# EAGLE design IRIS v1.1 (EAGLE 6.5.0)
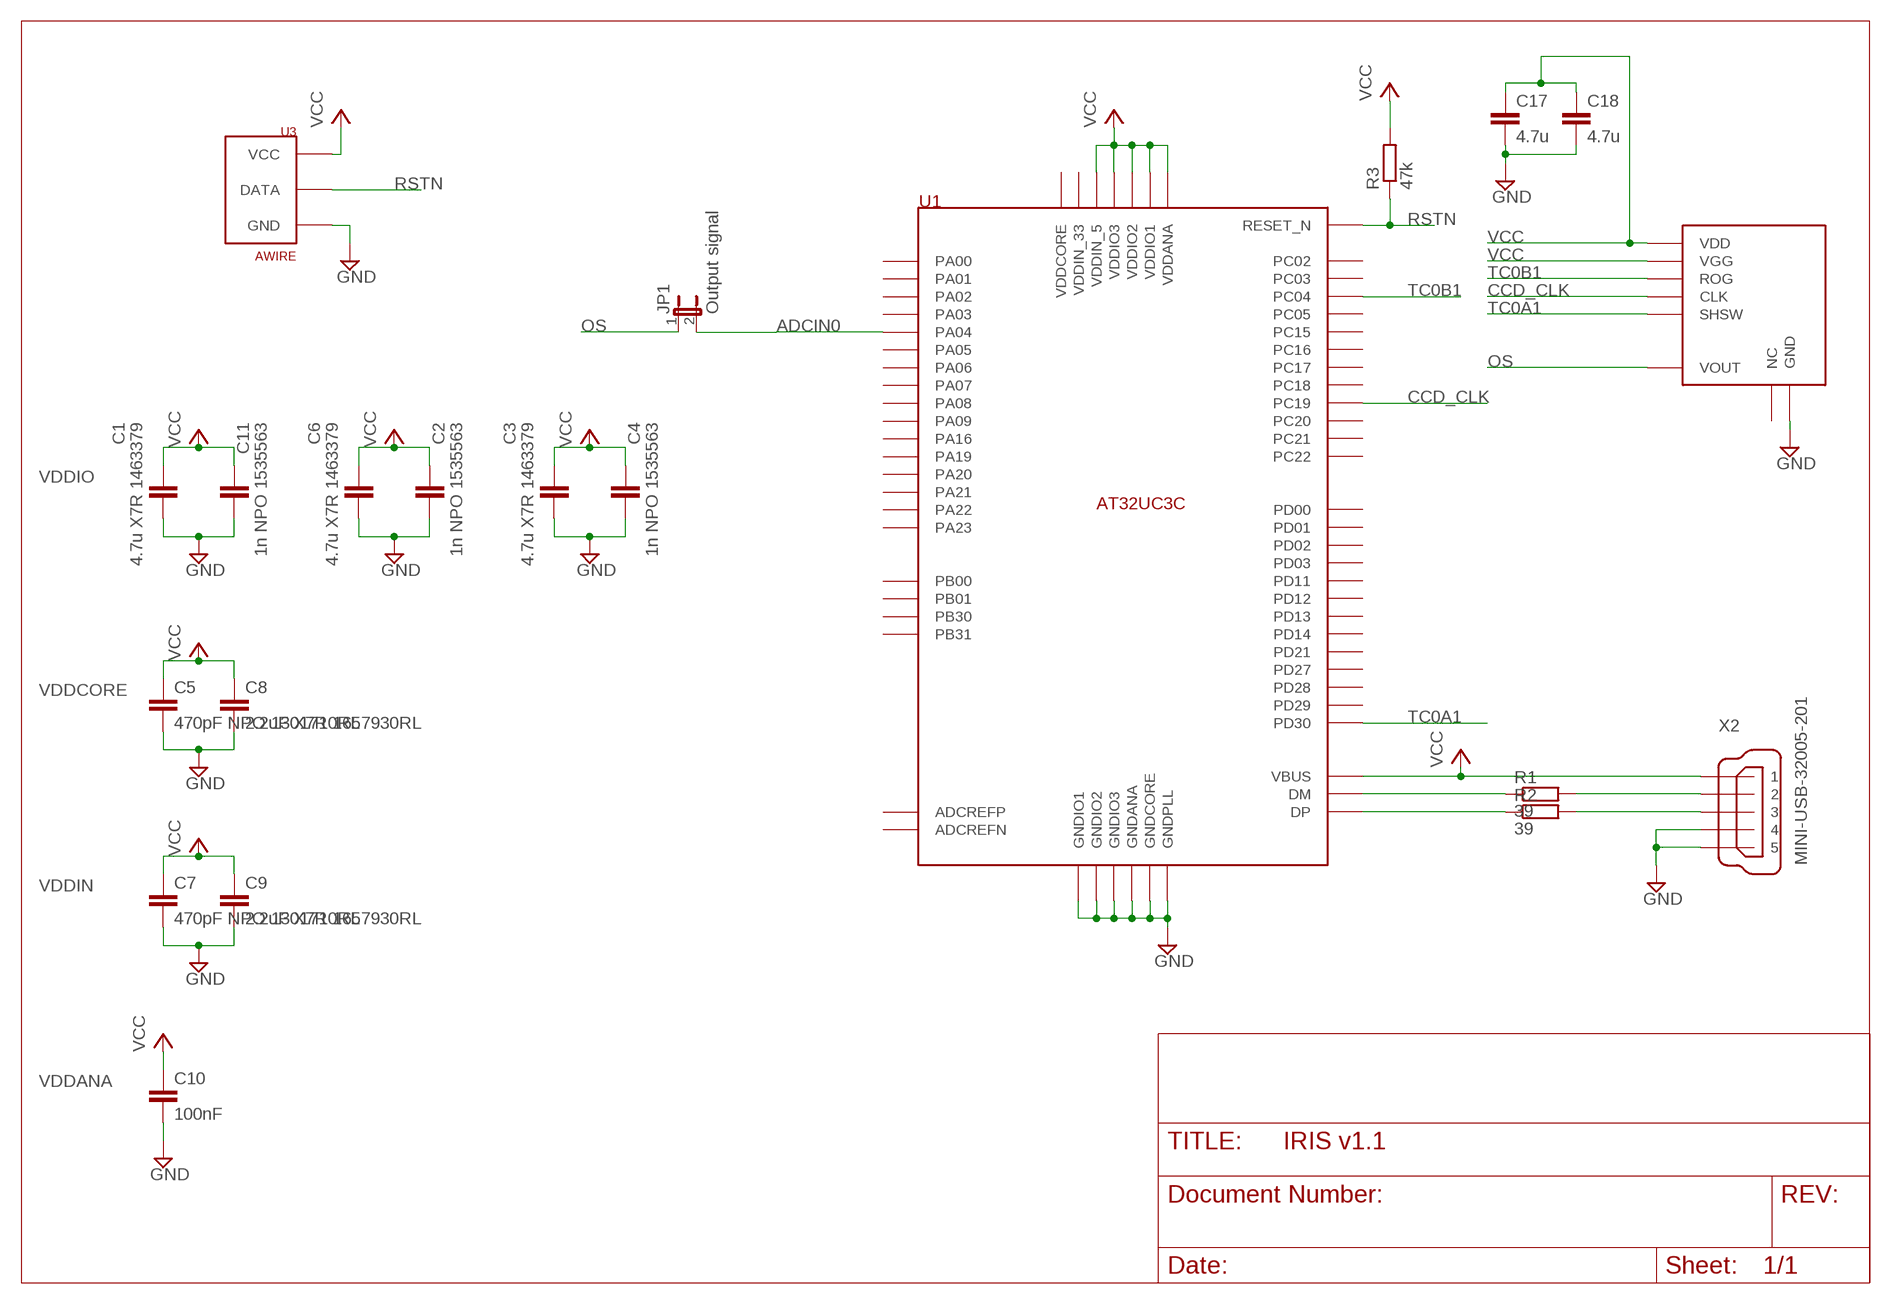
[diagram p0: schematic, sheet 1]

## Parts
C1  4.7u X7R 1463379  C-EUC0603  [C0603]
C2  1n NPO 1535563  C-EUC0402  [C0402]
C3  4.7u X7R 1463379  C-EUC0603  [C0603]
C4  1n NPO 1535563  C-EUC0402  [C0402]
C5  470pF NPO 1301710RL  C-EUC0603  [C0603]
C6  4.7u X7R 1463379  C-EUC0603  [C0603]
C7  470pF NPO 1301710RL  C-EUC0603  [C0603]
C8  2.2uF X7R 1657930RL  C-EUC0603  [C0603]
C9  2.2uF X7R 1657930RL  C-EUC0603  [C0603]
C10  100nF  C-EUC0603  [C0603]
C11  1n NPO 1535563  C-EUC0402  [C0402]
C17  4.7u  C-EUC0805  [C0805]
C18  4.7u  C-EUC0805  [C0805]
JP1  Output signal  JP1E  [JP1]
R1  39  R-EU_R0603  [R0603]
R2  39  R-EU_R0603  [R0603]
R3  47k  R-EU_R0603  [R0603]
U1  AT32UC3C  [TQFP64]
U3  AWIRE  [AWIRE]
U$1  ILX511  [ILX511]
X2  MINI-USB-32005-201  [32005-201]

## Nets
ADCIN0: JP1.2 U1.P$7(PA04)
CCD_CLK: U1.P$43(PC19) U$1.P$5(CLK)
GND: C1.2 C2.2 C3.2 C4.2 C5.2 C6.2 C7.2 C8.2 C9.2 C10.2 C11.2 C17.2 C18.2 U1.P$6(GNDIO1) U1.P$17(GNDANA) U1.P$26(GNDPLL) U1.P$30(GNDCORE) U1.P$36(GNDIO2) U1.P$52(GNDIO3) U3.P$3(GND) U$1.P$2(GND) U$1.P$3(GND) U$1.P$12(GND) U$1.P$16(GND) U$1.P$17(GND) U$1.P$19(GND) X2.4 X2.5
N$1: R1.1 U1.P$24(DM)
N$2: R2.1 U1.P$25(DP)
N$3: R1.2 X2.2
N$4: R2.2 X2.3
OS: JP1.1 U$1.P$1(VOUT)
RSTN: R3.1 U1.P$64(RESET_N) U3.P$2(DATA)
TC0A1: U1.P$61(PD30) U$1.P$4(SHSW)
TC0B1: U1.P$37(PC04) U$1.P$11(ROG)
VCC: C1.1 C2.1 C3.1 C4.1 C5.1 C6.1 C7.1 C8.1 C9.1 C10.1 C11.1 C17.1 C18.1 R3.2 U1.P$5(VDDIO1) U1.P$18(VDDANA) U1.P$23(VBUS) U1.P$27(VDDIN_5) U1.P$35(VDDIO2) U1.P$51(VDDIO3) U3.P$1(VCC) U$1.P$6(VDD) U$1.P$9(VDD) U$1.P$15(VDD) U$1.P$18(VGG) U$1.P$20(VDD) U$1.P$21(VDD) U$1.P$22(VDD) X2.1
Unconnected: U1.P$1(PA00) U1.P$2(PA01) U1.P$3(PA02) U1.P$4(PA03) U1.P$8(PA05) U1.P$9(PA06) U1.P$10(PA07) U1.P$11(PA08) U1.P$12(PA09) U1.P$13(PA16) U1.P$14(ADCREFP) U1.P$15(ADCREFN) U1.P$16(PA19) U1.P$19(PA20) U1.P$20(PA21) U1.P$21(PA22) U1.P$22(PA23) U1.P$28(VDDIN_33) U1.P$29(VDDCORE) U1.P$31(PB30) U1.P$32(PB31) U1.P$33(PC02) U1.P$34(PC03) U1.P$38(PC05) U1.P$39(PC15) U1.P$40(PC16) U1.P$41(PC17) U1.P$42(PC18) U1.P$44(PC20) U1.P$45(PC21) U1.P$46(PC22) U1.P$47(PD00) U1.P$48(PD01) U1.P$49(PD02) U1.P$50(PD03) U1.P$53(PD11) U1.P$54(PD12) U1.P$55(PD13) U1.P$56(PD14) U1.P$57(PD21) U1.P$58(PD27) U1.P$59(PD28) U1.P$60(PD29) U1.P$62(PB00) U1.P$63(PB01) U$1.P$7(NC) U$1.P$8(NC) U$1.P$10(NC) U$1.P$13(NC) U$1.P$14(NC)

## Notes on the sheet
- VDDIO
- VDDCORE
- VDDIN
- VDDANA

## Library data of the parts
C1-C11 = rcl:C-EU: CAPACITOR, European symbol
C17 C18 = resistor:C-EU: CAPACITOR, European symbol
JP1 = jumper:JP1E: JUMPER
R1-R3 = rcl:R-EU_: RESISTOR, European symbol
U1 = IRIS:AT32UC3C
U3 = IRIS:AWIRE
U$1 = SpectroLib:ILX511
X2 = con-cypressindustries:MINI-USB-: MINI USB-B Conector Source: www.cypressindustries.com; OC_FARNELL: unknown; OC_NEWARK: unknown

## Board
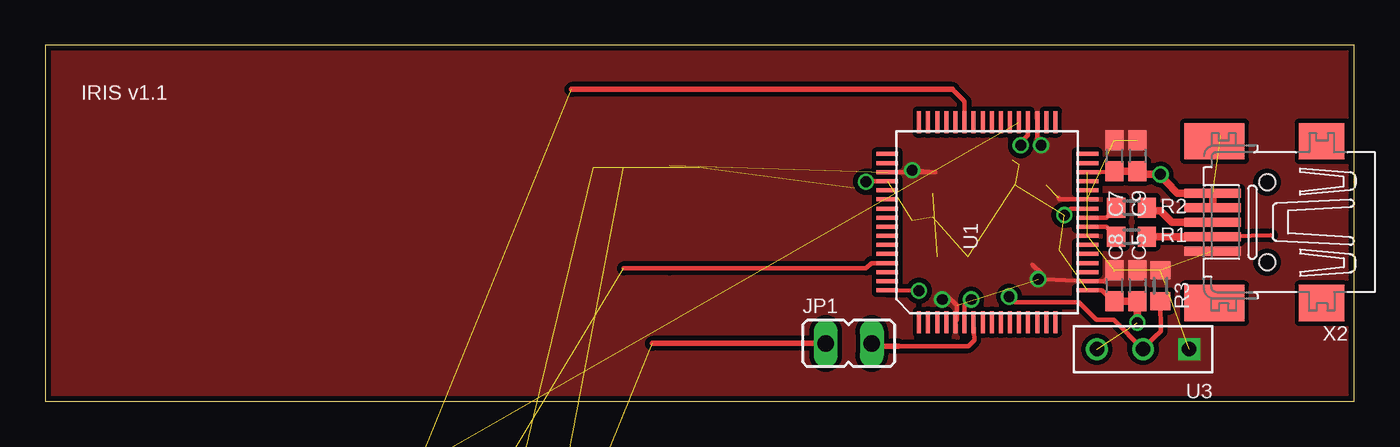
[diagram p1: board, top side]
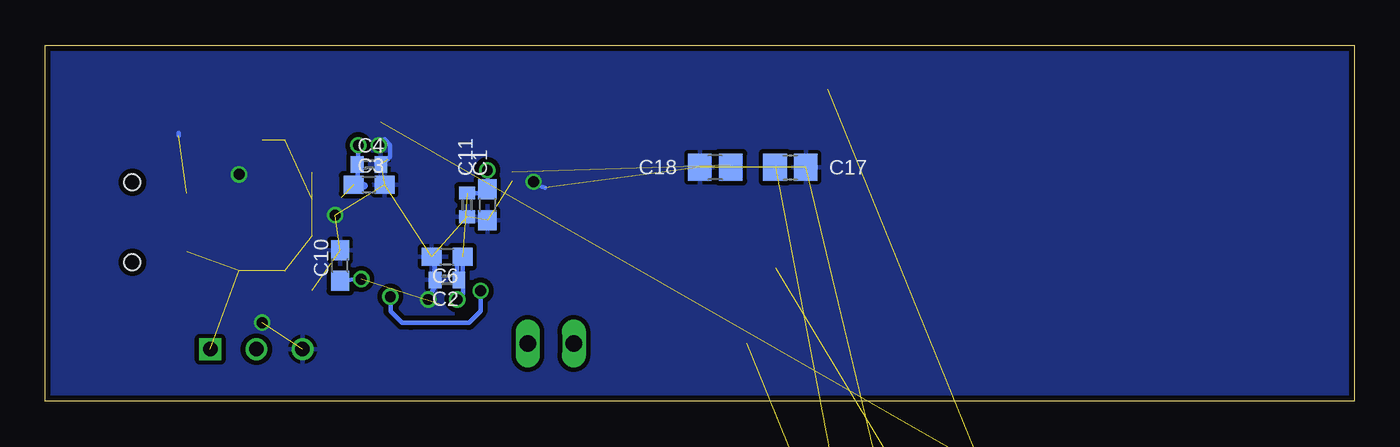
[diagram p2: board, bottom side, seen from below]

Size 71.98 x 19.56 mm. Coordinates in mm from the lower left corner, seen from the top.
Outline: 0,0 71.98,0 71.98,19.56 0,19.56 0,0
Copper layers (1*16): Top 0.035mm / dielectric 1.5mm / Bottom 0.035mm
Design rules "default": minimum track width 0.15mm, minimum drill 0.3mm, track to track 0.15mm, track to pad 0.15mm, pad to pad 0.15mm, via to via 0.15mm, smd to smd 0.15mm, copper to edge 0.3mm, drill to drill 0.2mm, minimum pad ring 0.2mm, minimum via ring 0.15mm, stop-mask expansion 0.075mm, vias tented up to drill 0mil, thermal gap 0.2mm

### Footprints (pad centres in the part's own frame; a part is rotated, then mirrored left to right if it is on the bottom)
C0603 = smd 1.1 x 1: 1 -0.85,0; 2 0.85,0
C0402 = smd 0.7 x 0.9: 1 -0.65,0; 2 0.65,0
C0805 = smd 1.3 x 1.5: 1 -0.85,0; 2 0.85,0
JP1 = drill 0.914 long: 1 0,-1.27; 2 0,1.27
R0603 = smd 1 x 1.1: 1 -0.85,0; 2 0.85,0
TQFP64 = smd 1.2 x 0.22: P$1 -5.5,3.75; P$2 -5.5,3.25; P$3 -5.5,2.75; P$4 -5.5,2.25; P$5 -5.5,1.75; P$6 -5.5,1.25; P$7 -5.5,0.75; P$8 -5.5,0.25; P$9 -5.5,-0.25; P$10 -5.5,-0.75; P$11 -5.5,-1.25; P$12 -5.5,-1.75; P$13 -5.5,-2.25; P$14 -5.5,-2.75; P$15 -5.5,-3.25; P$16 -5.5,-3.75; P$33 5.5,-3.75; P$34 5.5,-3.25; P$35 5.5,-2.75; P$36 5.5,-2.25; P$37 5.5,-1.75; P$38 5.5,-1.25; P$39 5.5,-0.75; P$40 5.5,-0.25; P$41 5.5,0.25; P$42 5.5,0.75; P$43 5.5,1.25; P$44 5.5,1.75; P$45 5.5,2.25; P$46 5.5,2.75; P$47 5.5,3.25; P$48 5.5,3.75 | smd 0.22 x 1.2: P$17 -3.75,-5.5; P$18 -3.25,-5.5; P$19 -2.75,-5.5; P$20 -2.25,-5.5; P$21 -1.75,-5.5; P$22 -1.25,-5.5; P$23 -0.75,-5.5; P$24 -0.25,-5.5; P$25 0.25,-5.5; P$26 0.75,-5.5; P$27 1.25,-5.5; P$28 1.75,-5.5; P$29 2.25,-5.5; P$30 2.75,-5.5; P$31 3.25,-5.5; P$32 3.75,-5.5; P$49 3.75,5.5; P$50 3.25,5.5; P$51 2.75,5.5; P$52 2.25,5.5; P$53 1.75,5.5; P$54 1.25,5.5; P$55 0.75,5.5; P$56 0.25,5.5; P$57 -0.25,5.5; P$58 -0.75,5.5; P$59 -1.25,5.5; P$60 -1.75,5.5; P$61 -2.25,5.5; P$62 -2.75,5.5; P$63 -3.25,5.5; P$64 -3.75,5.5
AWIRE = drill 0.8 square: P$1 -2.54,1.27 | drill 0.8: P$2 0,1.27; P$3 2.54,1.27
ILX511 = drill 0.8 square: P$1 0,0 | drill 0.8: P$2 -2.54,0; P$3 -5.08,0; P$4 -7.62,0; P$5 -10.16,0; P$6 -12.7,0; P$7 -15.24,0; P$8 -17.78,0; P$9 -20.32,0; P$10 -22.86,0; P$11 -25.4,0; P$12 -25.4,-2.54; P$13 -22.86,-2.54; P$14 -20.32,-2.54; P$15 -17.78,-2.54; P$16 -15.24,-2.54; P$17 -12.7,-2.54; P$18 -10.16,-2.54; P$19 -7.62,-2.54; P$20 -5.08,-2.54; P$21 -2.54,-2.54; P$22 0,-2.54
32005-201 = smd 3.1 x 0.5: 1 3,1.6; 2 3,0.8; 3 3,0; 4 3,-0.8; 5 3,-1.6 | smd 2.5 x 2: M1 -3,-4.45; M2 -3,4.45 | smd 3.3 x 2: M3 2.9,4.45; M4 2.9,-4.45 | hole 0.9: 0,2.2; 0,-2.2

### Placement (x,y rotation side)
C1  47.67,10.79 270 bottom
C2  49.9,6.67 180 bottom
C3  54.18,11.91 0 bottom
C4  54.18,13.02 0 bottom
C5  60.05,6.35 270 top
C6  49.9,7.94 180 bottom
C7  58.78,13.49 270 top
C8  58.78,6.35 270 top
C9  60.05,13.49 270 top
C10  55.77,7.46 90 bottom
C11  48.78,10.79 270 bottom
C17  31,12.86 0 bottom
C18  35.13,12.86 180 bottom
JP1  44.18,3.17 270 top
R1  59.74,9.05 0 top
R2  59.74,10.64 0 top
R3  61.33,6.35 90 top
U1  51.8,9.84 90 top
U3  60.37,4.13 180 top
U$1  26,-15 0 top  (outside the outline)
X2  67.2,9.84 180 top

### Tracks (layer width: path | path; a pad name or v marks a point on that pad's centre or on a via)
ADCIN0
  Top 0.254: 46.93,3.03 49.97,3.03 50.77,3.03 51.09,3.35 U1.P$7
  Top 0.305: 46.93,3.03 45.59,3.03 JP1.2
CCD_CLK  (1 unrouted)
  Top 0.254: U1.P$43 50.55,16.49 49.9,17.14
  Top 0.305: 49.9,17.14 28.94,17.14
GND  (via drill 0.6, 0.6 pad 0.25)  (20 unrouted)
  Top 0.254: C8.2 58.61,5.59 58.16,6.04 | 58.16,6.04 58.13,6.07 | 58.13,6.07 | U1.P$26 56.41,10.59 v56.05,10.23 | U1.P$30 57.99,12.59 C7.2 | U1.P$36 54.05,14.63 53.7,14.29 53.65,14.23 v53.65,14.07 | U1.P$17 58.09,6.09 | 58.09,6.09 58.15,6.03 | 58.09,6.09 58.1,6.09 58.16,6.04 | U1.P$6 50.55,5.26 50.85,5.56 50.89,5.56 v50.93,5.59 | U1.P$52 45.16,12.09 v45.13,12.06
  Top 0.406: C7.2 C9.2 60.23,12.47 v61.33,12.47 61.33,12.38 61.64,12.06 62.27,11.44 X2.5 X2.4 | C8.2 C5.2 60.06,4.64 v60.06,4.32
  Bottom 0.254: C6.2 50.61,7.83 C2.2 50.61,6.23 | 50.61,6.23 | 50.61,6.23 v50.93,5.59 | v53.65,14.07 53.33,14.39 53.01,14.07 53.01,13.43 53.17,13.27 | 64.66,14.76 64.66,14.61 | v45.13,12.06 44.97,11.91 44.5,11.75
  pour Bottom (isolate 0.254): -0.68,20.92 73.14,20.92 72.98,-0.16 -1,0
N$1
  Top 0.254: U1.P$24 58.34,9.59 R1.1
N$2
  Top 0.254: U1.P$25 58.34,10.09 R2.1
N$3
  Top 0.254: 67.41,9.11 X2.2
  Top 0.406: X2.2 R1.2
N$4
  Top 0.406: X2.3 61.96,9.84 61.33,10.48 60.69,10.48 60.59,10.58 R2.2
OS  (1 unrouted)
  Top 0.305: JP1.1 41.64,3.17 33.38,3.17
RSTN  (via drill 0.6 pad 0.25)
  Top 0.254: U1.P$64 v48.05,6.07 | v53.01,5.75 53.33,5.43 | 53.33,5.43 56.85,5.43 57.81,4.47 58.77,4.47 U3.P$2 61.01,3.51 61.34,3.84 R3.1 | v53.01,5.75 53.33,5.43 | 53.33,5.43 v53.01,5.75
  Bottom 0.254: v48.05,6.07 48.05,4.95 48.69,4.3 51.89,4.3 52.37,4.32 53,4.96 v53.01,5.75
TC0A1  (1 unrouted)
  Top 0.254: U1.P$61 45.42,7.59 45.13,7.3 34.34,7.3 31.8,7.3
TC0B1  (1 unrouted)
VCC  (via drill 0.6, 0.6 pad 0.25)  (21 unrouted)
  Top 0.254: U1.P$5 50.13,4.47 50.13,5.27 49.65,5.75 v49.33,5.59 | 55.73,11.19 arc-90 55.73,11.19 | v54.77,14.07 54.61,14.39 v54.77,14.07 | 54.29,7.51 54.77,7.03 v54.61,6.71 54.93,6.71 U1.P$18 58.23,6.59 58.78,7.14 | U1.P$35 54.55,14.45 v54.77,14.07 | 57.32,11.11 U1.P$27 55.83,11.09 arc-90 55.73,11.19 | U1.P$51 48.94,12.59 v47.67,12.7
  Bottom 0.254: v49.33,5.59 49.01,5.91 C6.1 49.33,7.83 49.33,6.39 49.17,6.39 C2.1 | C10.1 54.93,6.71 v54.61,6.71 | v54.77,14.07 54.77,12.95 54.77,13.11 C4.1 54.77,12.15 C3.1 | C11.1 47.82,11.45 47.67,11.59 C1.1 v47.67,12.7
  Bottom 0.406: C3.1 54.45,11.83 | C17.1 31.8,12.86
  Bottom 0.61: C18.1 34.34,12.96
  pour Top (isolate 0.254, no thermals): 75.14,15.4 75.14,0 -0.84,0 -0.84,20.4 74.98,20.4 74.98,15.24

### Text on the board
tPlace: IRIS v1.1